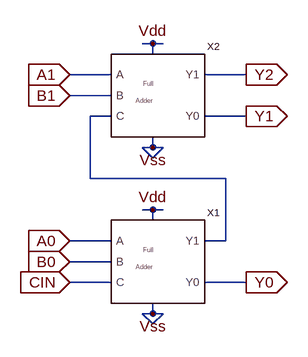
[diagram p0: schematic 2bitadder.asc]
2bitadder.asc, the LTspice schematic file:
Version 4
SHEET 1 1900 1012
WIRE 1104 544 1088 544
WIRE 1120 544 1104 544
WIRE 1104 560 1104 544
WIRE 1040 592 976 592
WIRE 1248 592 1184 592
WIRE 1040 624 976 624
WIRE 1040 656 1008 656
WIRE 1248 656 1184 656
WIRE 1104 704 1104 688
WIRE 1104 704 1088 704
WIRE 1120 704 1104 704
WIRE 1104 720 1088 704
WIRE 1104 720 1120 704
WIRE 1008 752 1008 656
WIRE 1216 752 1008 752
WIRE 1104 800 1088 800
WIRE 1120 800 1104 800
WIRE 1104 816 1104 800
WIRE 1040 848 976 848
WIRE 1216 848 1216 752
WIRE 1216 848 1184 848
WIRE 1040 880 976 880
WIRE 1040 912 976 912
WIRE 1248 912 1184 912
WIRE 1104 960 1104 944
WIRE 1104 960 1088 960
WIRE 1120 960 1104 960
WIRE 1104 976 1088 960
WIRE 1104 976 1120 960
FLAG 976 848 A0
IOPIN 976 848 In
FLAG 976 880 B0
IOPIN 976 880 In
FLAG 1104 800 Vdd
FLAG 1104 960 Vss
FLAG 976 592 A1
IOPIN 976 592 In
FLAG 976 624 B1
IOPIN 976 624 In
FLAG 1104 544 Vdd
FLAG 1104 704 Vss
FLAG 976 912 CIN
IOPIN 976 912 In
FLAG 1248 912 Y0
IOPIN 1248 912 Out
FLAG 1248 656 Y1
IOPIN 1248 656 Out
FLAG 1248 592 Y2
IOPIN 1248 592 Out
SYMBOL fulladder 1040 944 R0
SYMATTR InstName X1
SYMBOL fulladder 1040 688 R0
SYMATTR InstName X2

The netlist it stands for:
* 2bitadder.asc
XX1 A0 B0 Y0 N001 Vdd Vss CIN fulladder  ; pins A B Y0 Y1 Vdd Vss C
XX2 A1 B1 Y1 Y2 Vdd Vss N001 fulladder  ; pins A B Y0 Y1 Vdd Vss C
.backanno
.end